# EAGLE schematic bi-directional_mosfet_level_shifter (EAGLE 9.6.2)
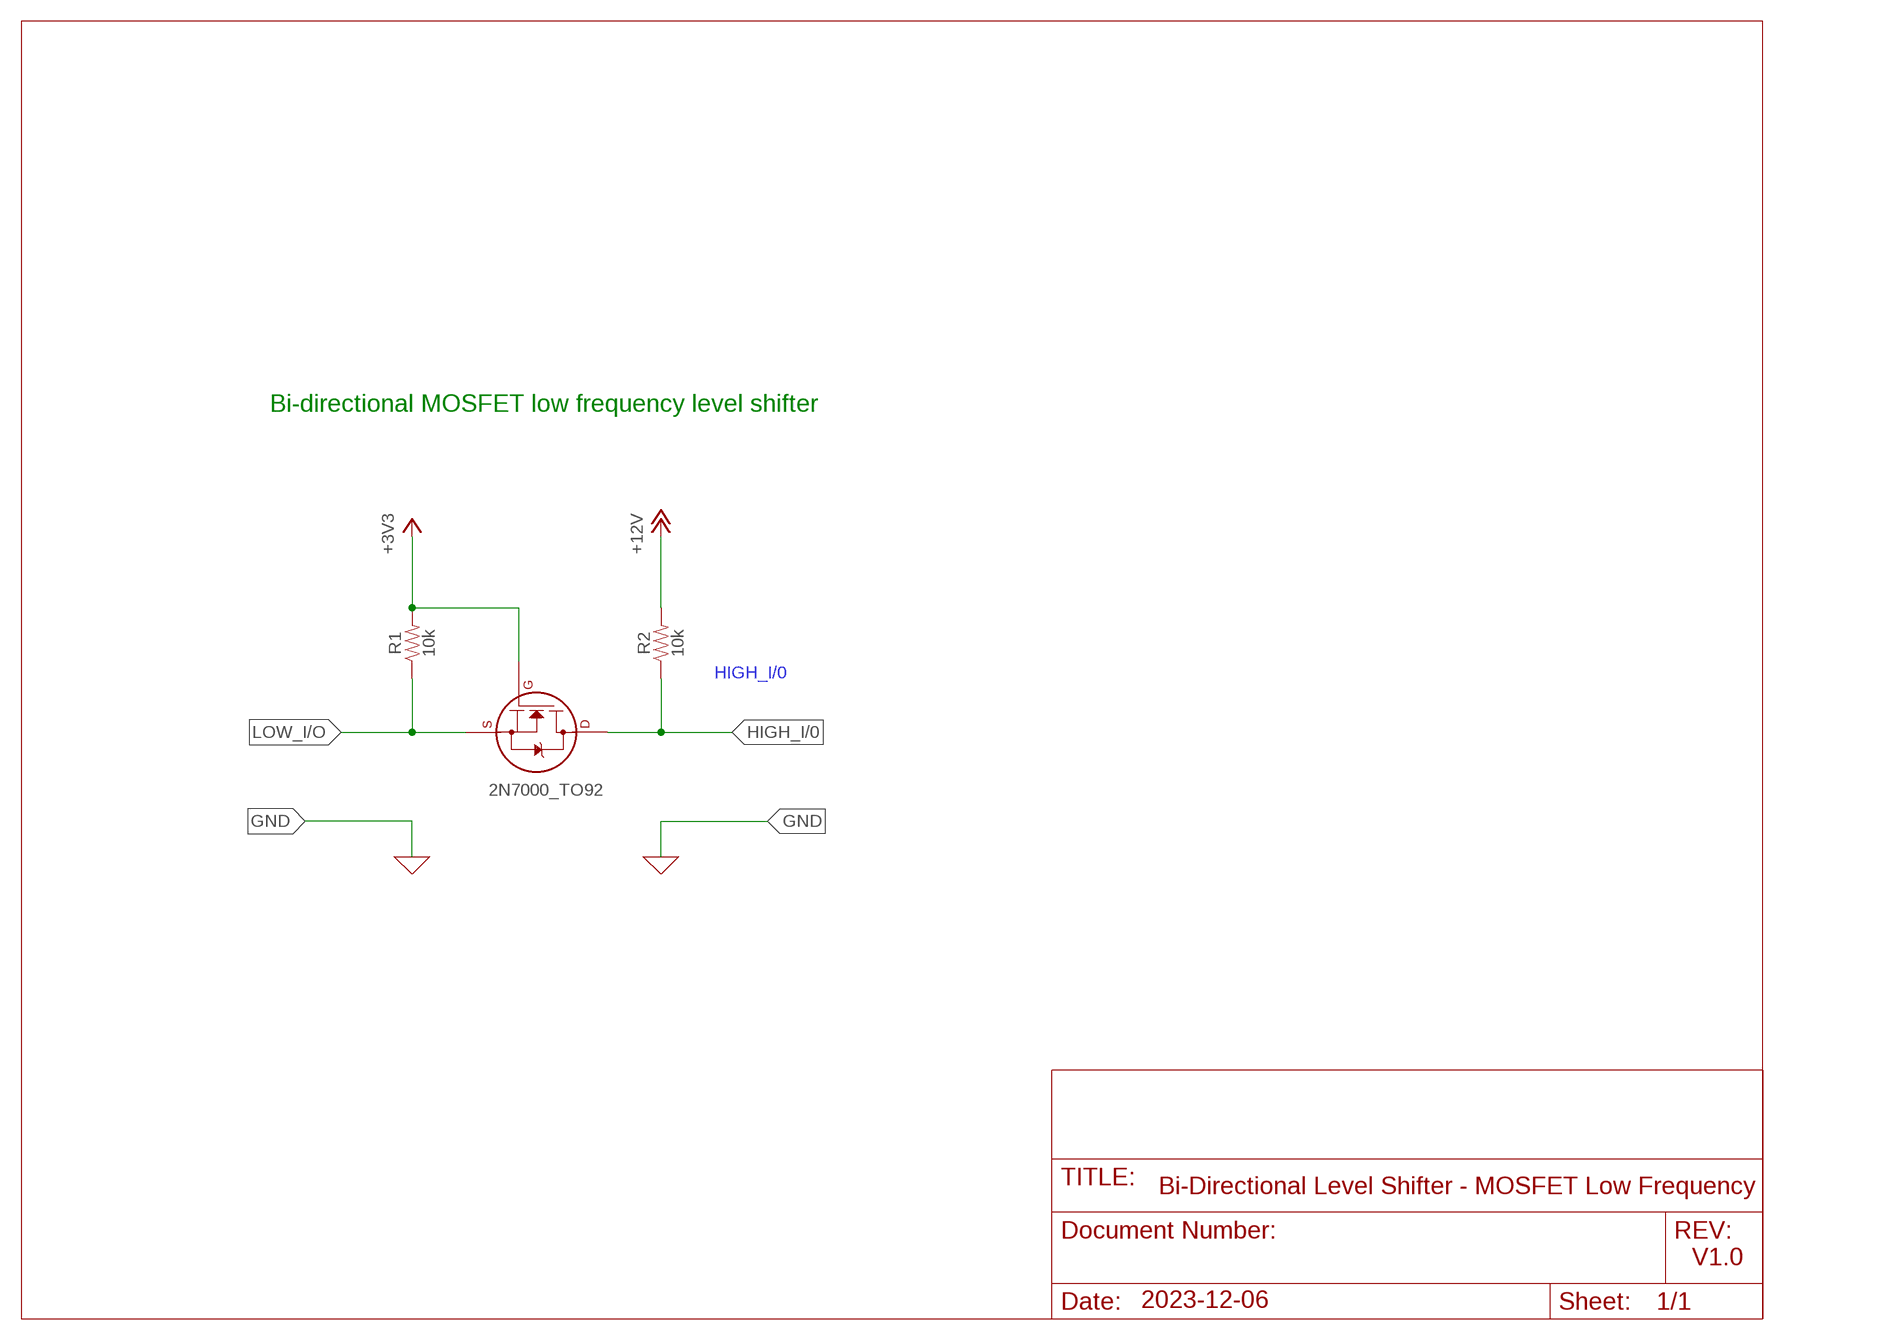
[diagram p0: schematic, sheet 1]
FRAME1 (LETTER_L): FRAME_NAME: Bi-Directional Level Shifter - MOSFET Low Frequency

## Parts
2N7000_TO92  2N7000_TO92  [TO-92]
R1  10k  10KOHM-HORIZ_KIT-1/4W-1%  [AXIAL-0.3-KIT]
R2  10k  10KOHM-HORIZ_KIT-1/4W-1%  [AXIAL-0.3-KIT]

## Nets
+3V3: 2N7000_TO92.2(G) R1.P$2
+12V: R2.P$2
HIGH_I/0: 2N7000_TO92.3(D) R2.P$1
LOW_I/O: 2N7000_TO92.1(S) R1.P$1

## Notes on the sheet
- Bi-directional MOSFET low frequency level shifter
- V1.0
- 2023-12-06

## Library data of the parts
2N7000_TO92 = transistors:2N700*: 2N7000, 2N7002, NDS7002A N-channel enhancement mode MOSFET
R1 R2 = SparkFun-Resistors:10KOHM: 10kΩ resistor A resistor is a passive two-terminal electrical component that implements electrical resistance as a circuit element. Resistors act to reduce current flow, and, at the same time, act to lower voltage levels within circuits. - Wikipedia; PROD_ID: RES-12183